# Altium schematic sheet Dual_chanel.SchDoc
size A1; SheetNumber: 2; SheetTotal: 2
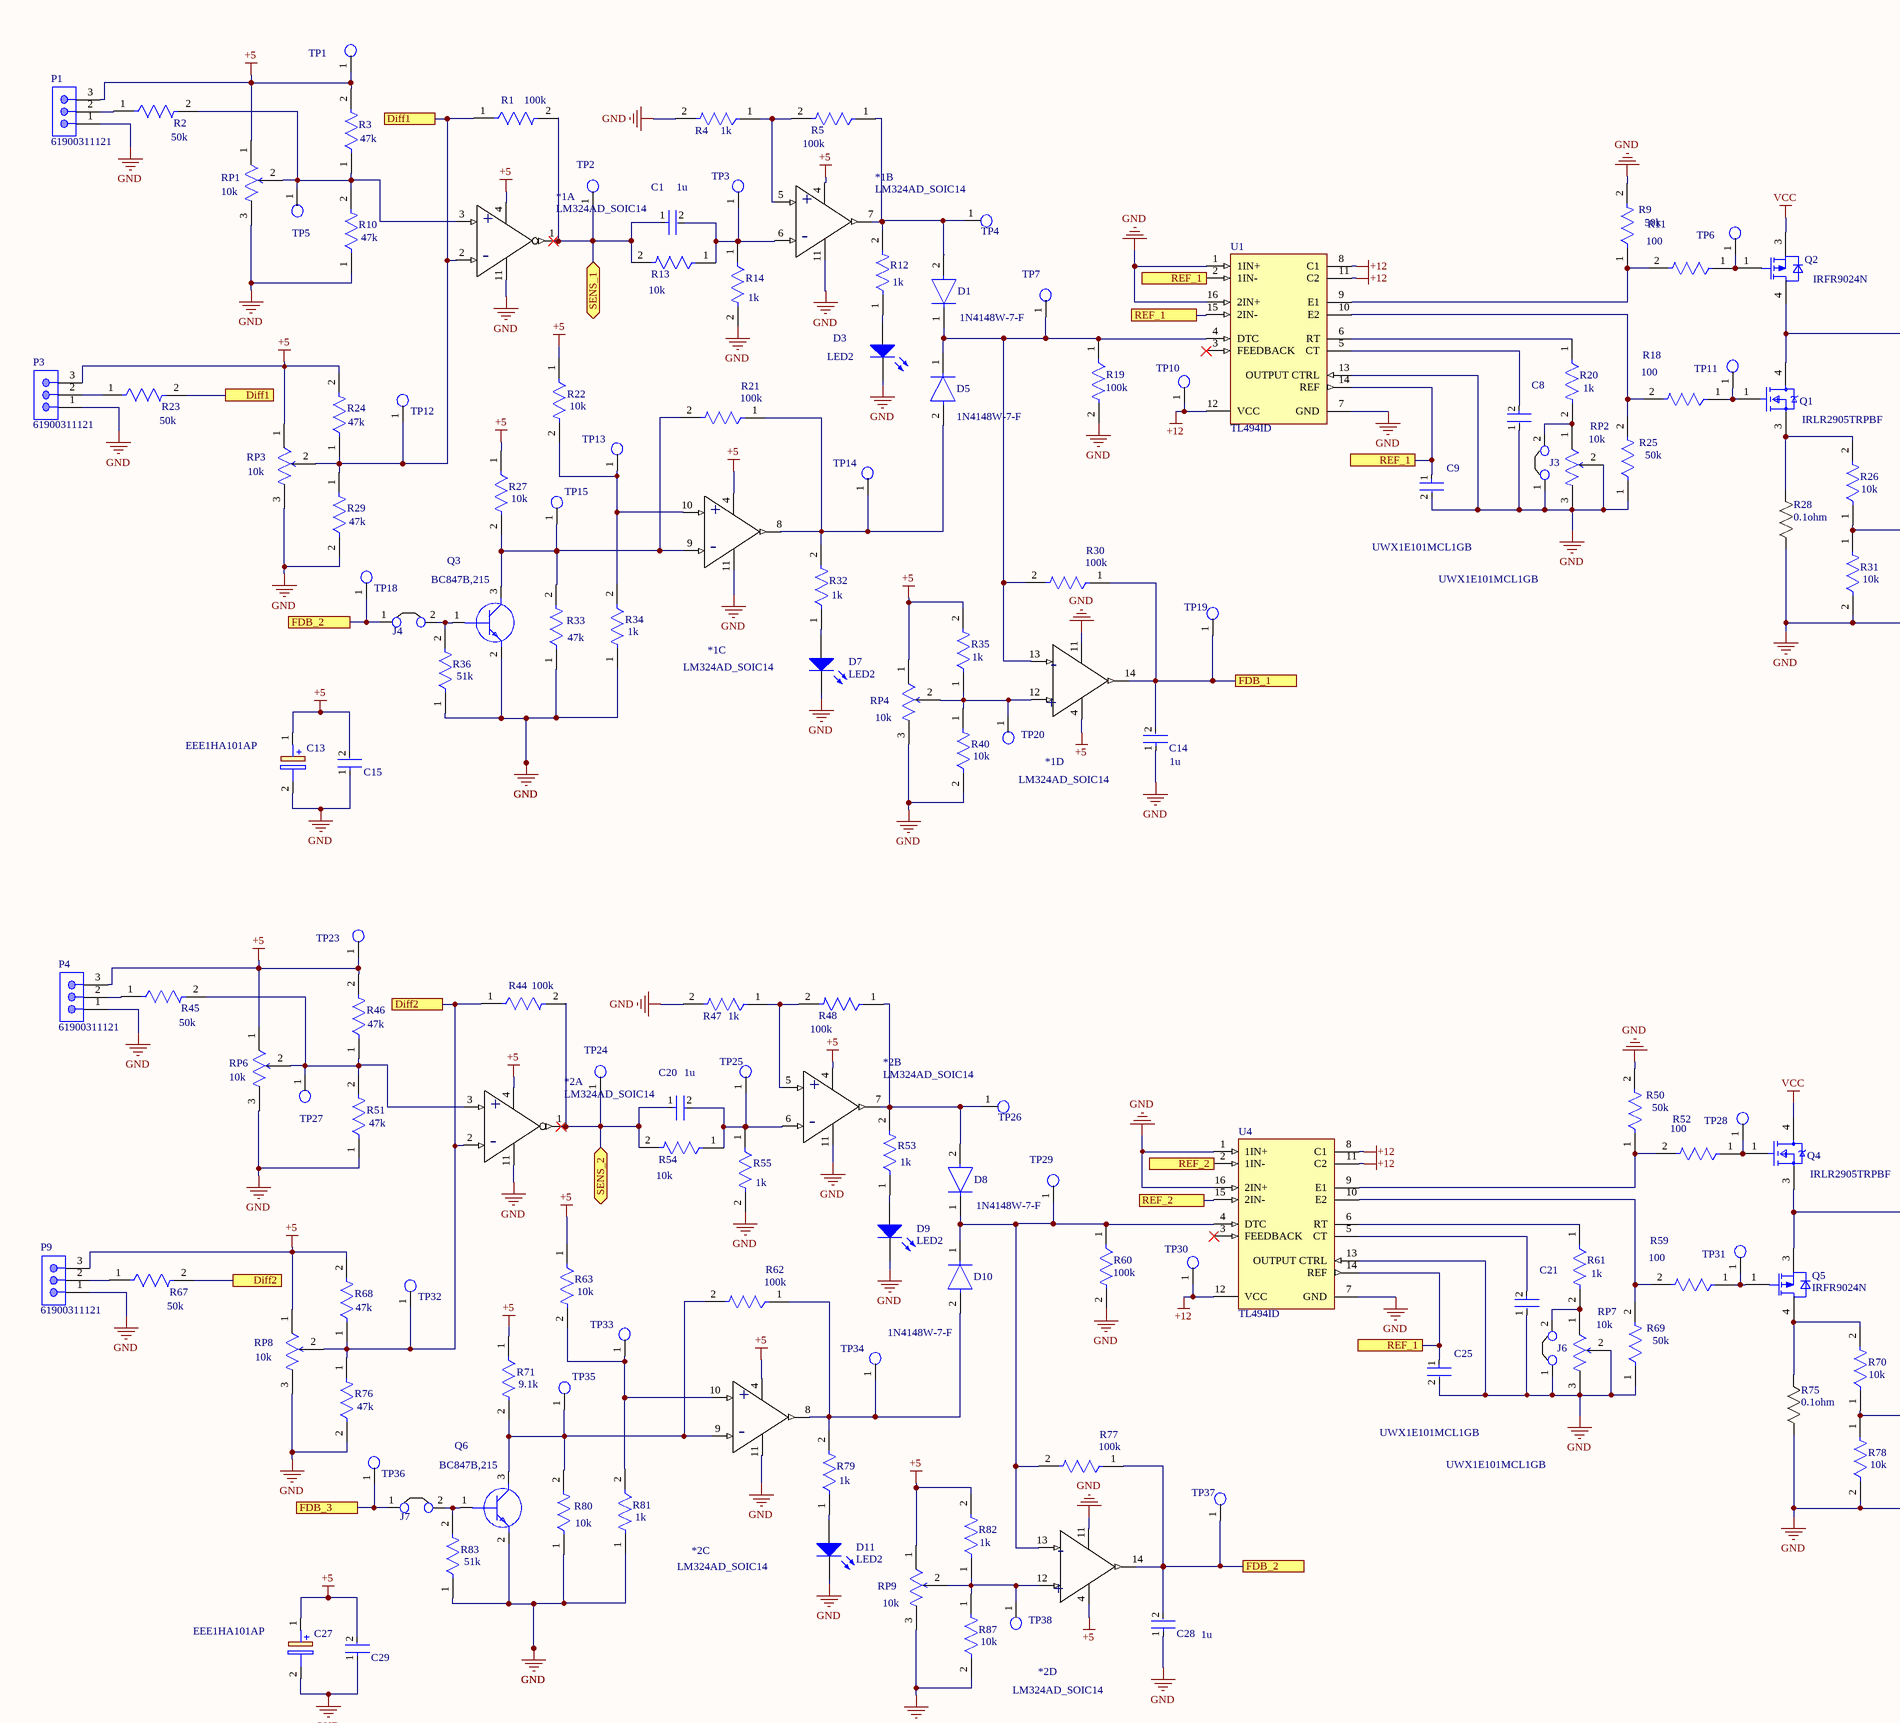
[diagram p0: Dual_chanel.SchDoc, top left]
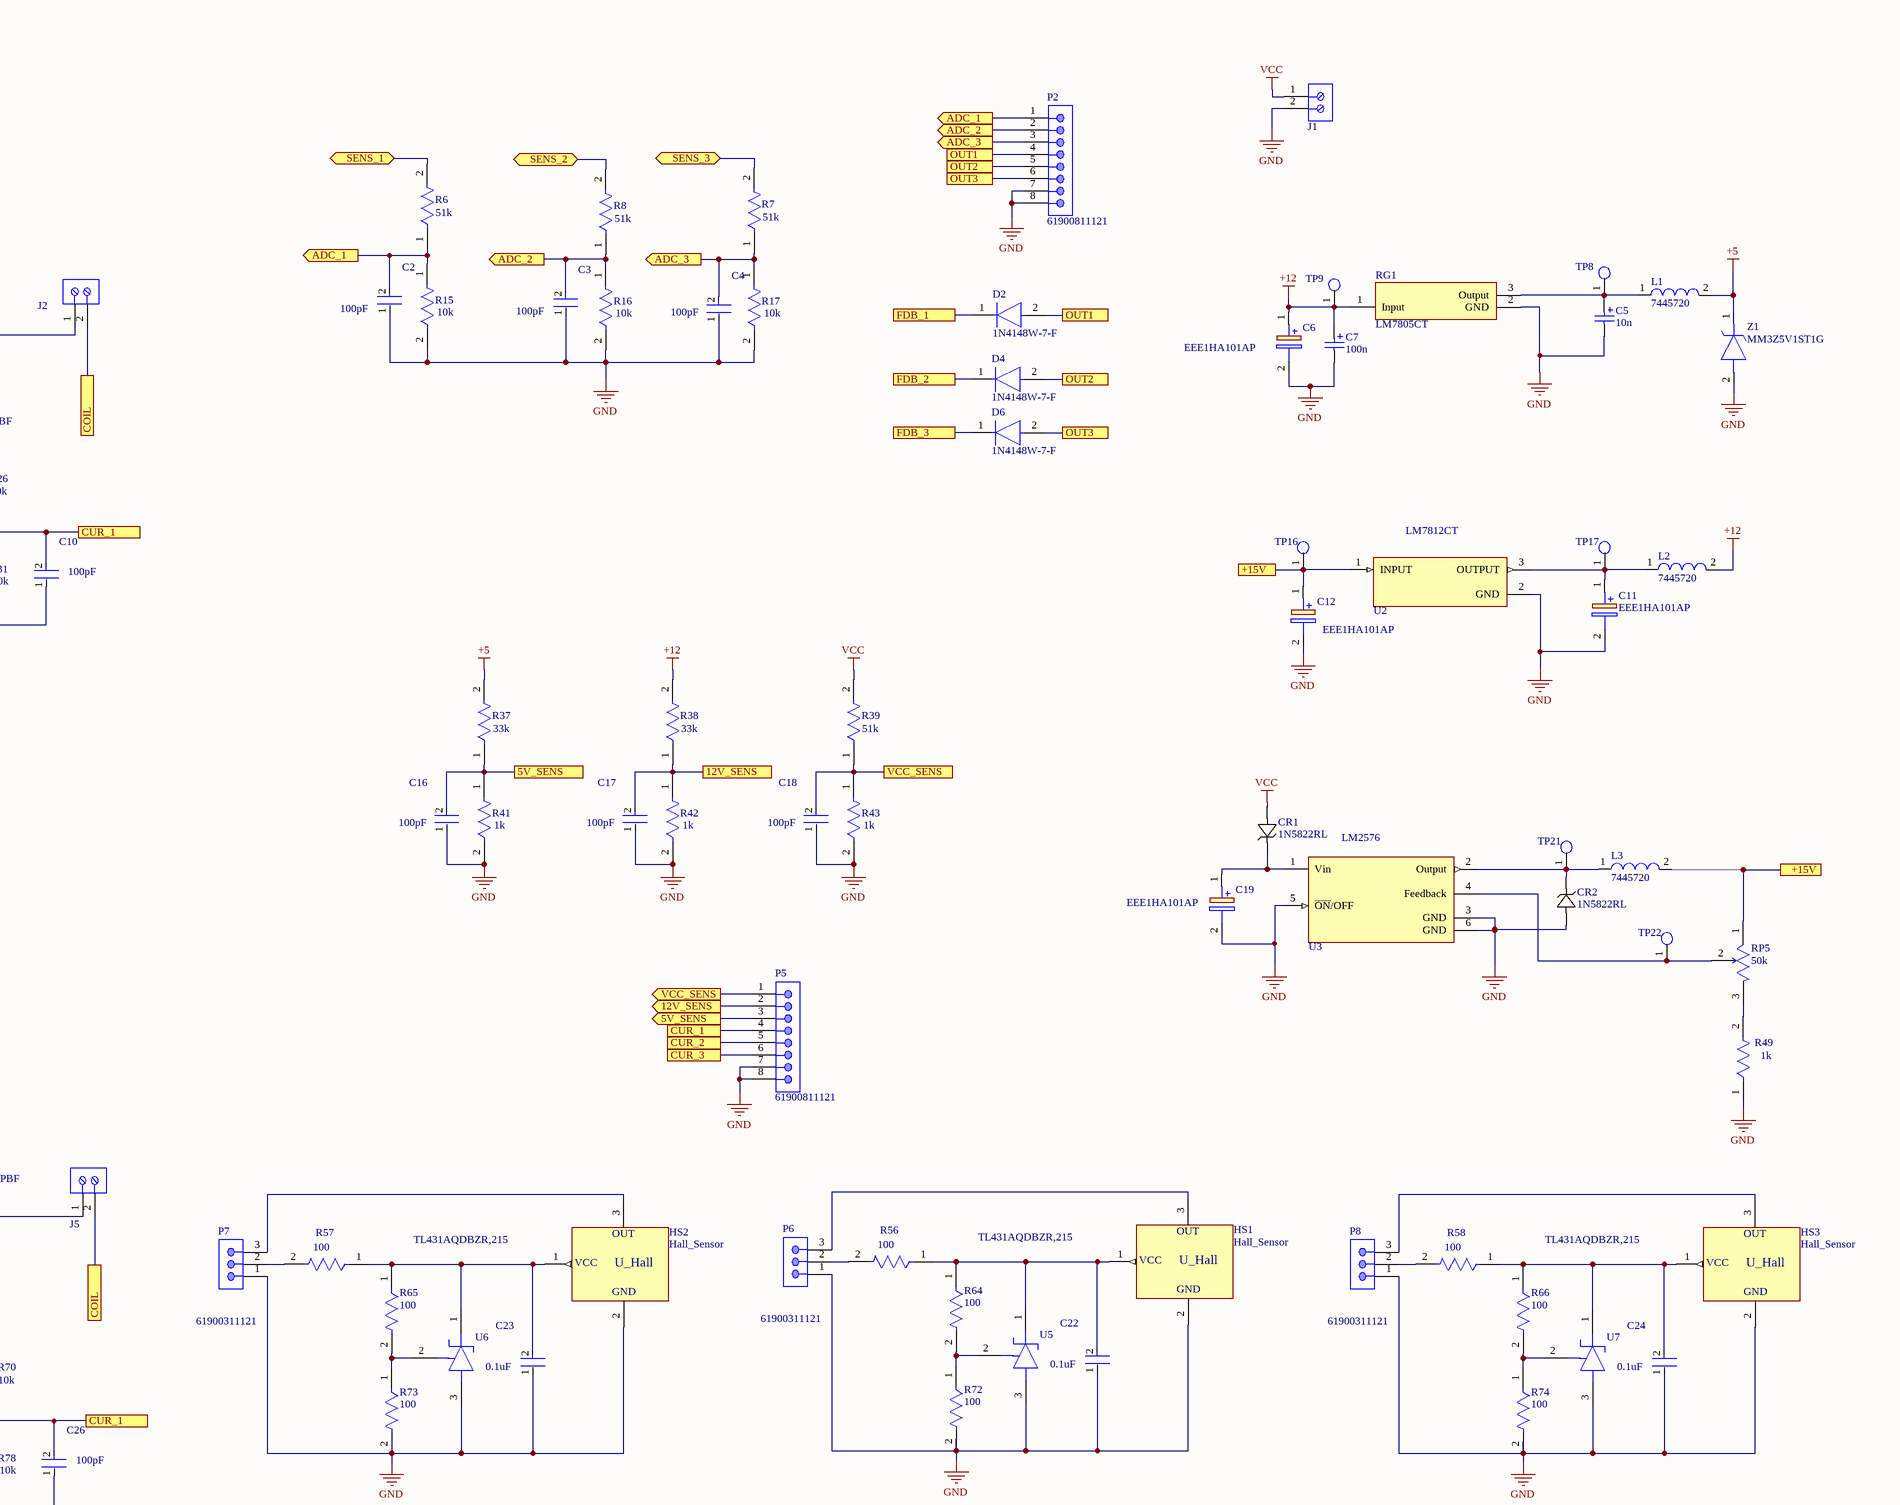
[diagram p1: Dual_chanel.SchDoc, top right]
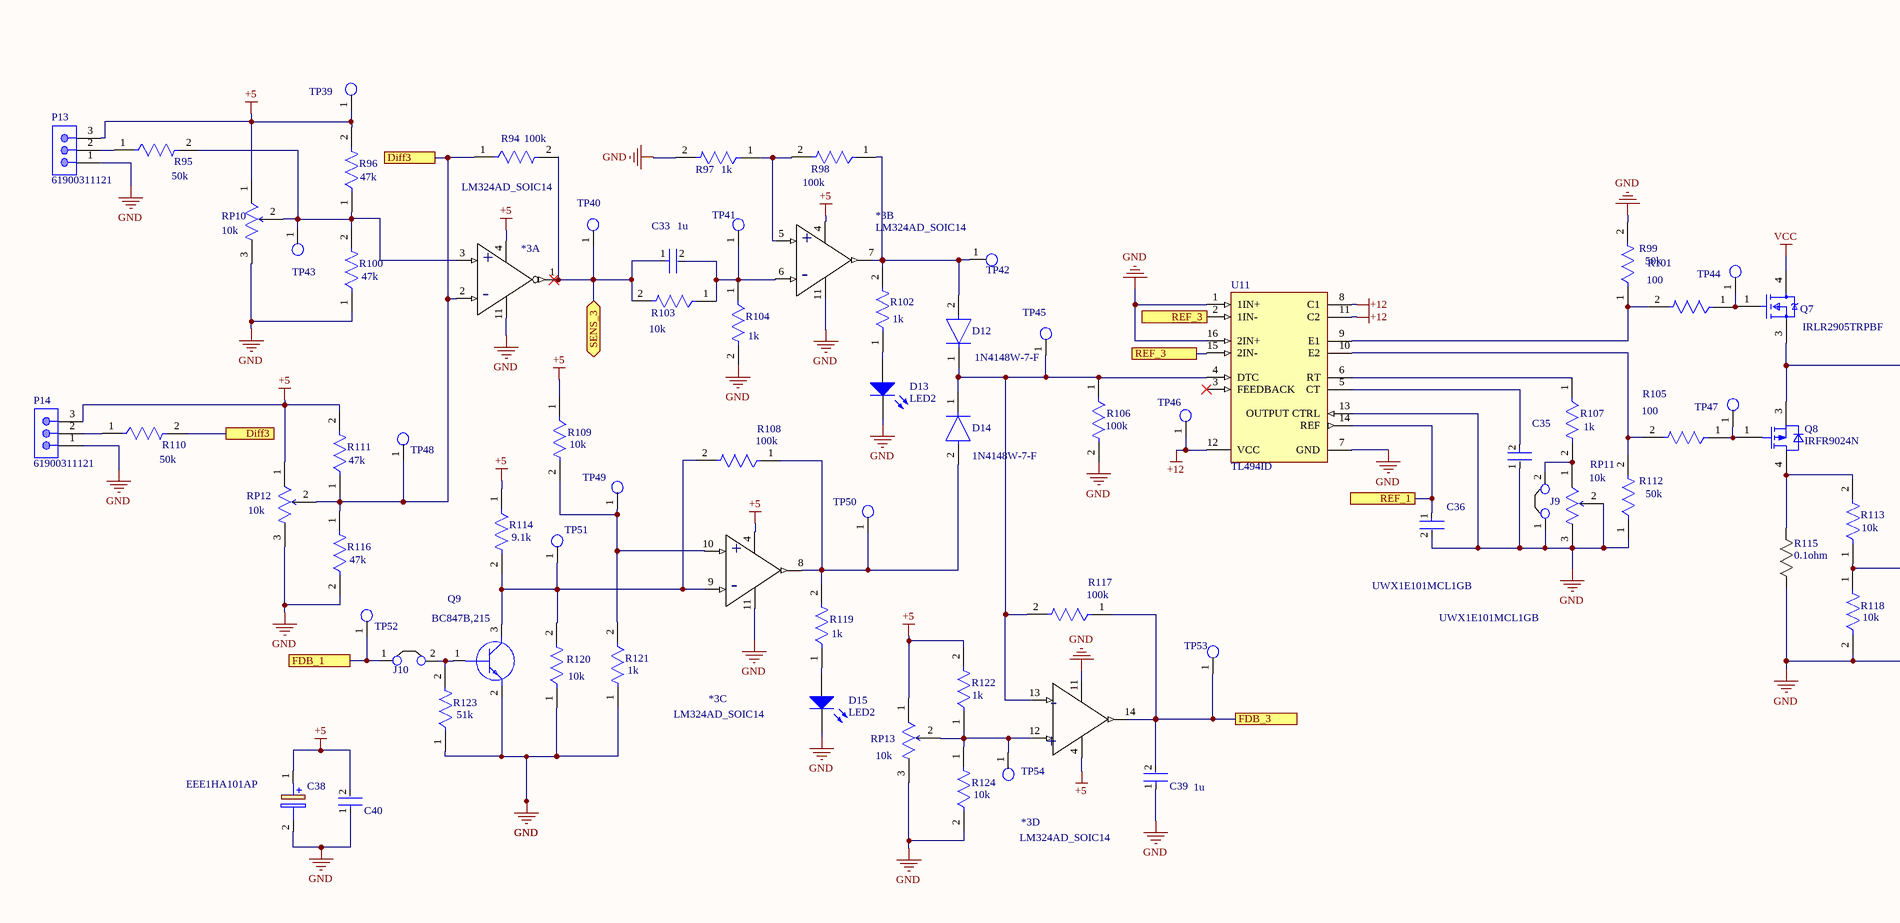
[diagram p2: Dual_chanel.SchDoc, bottom left]
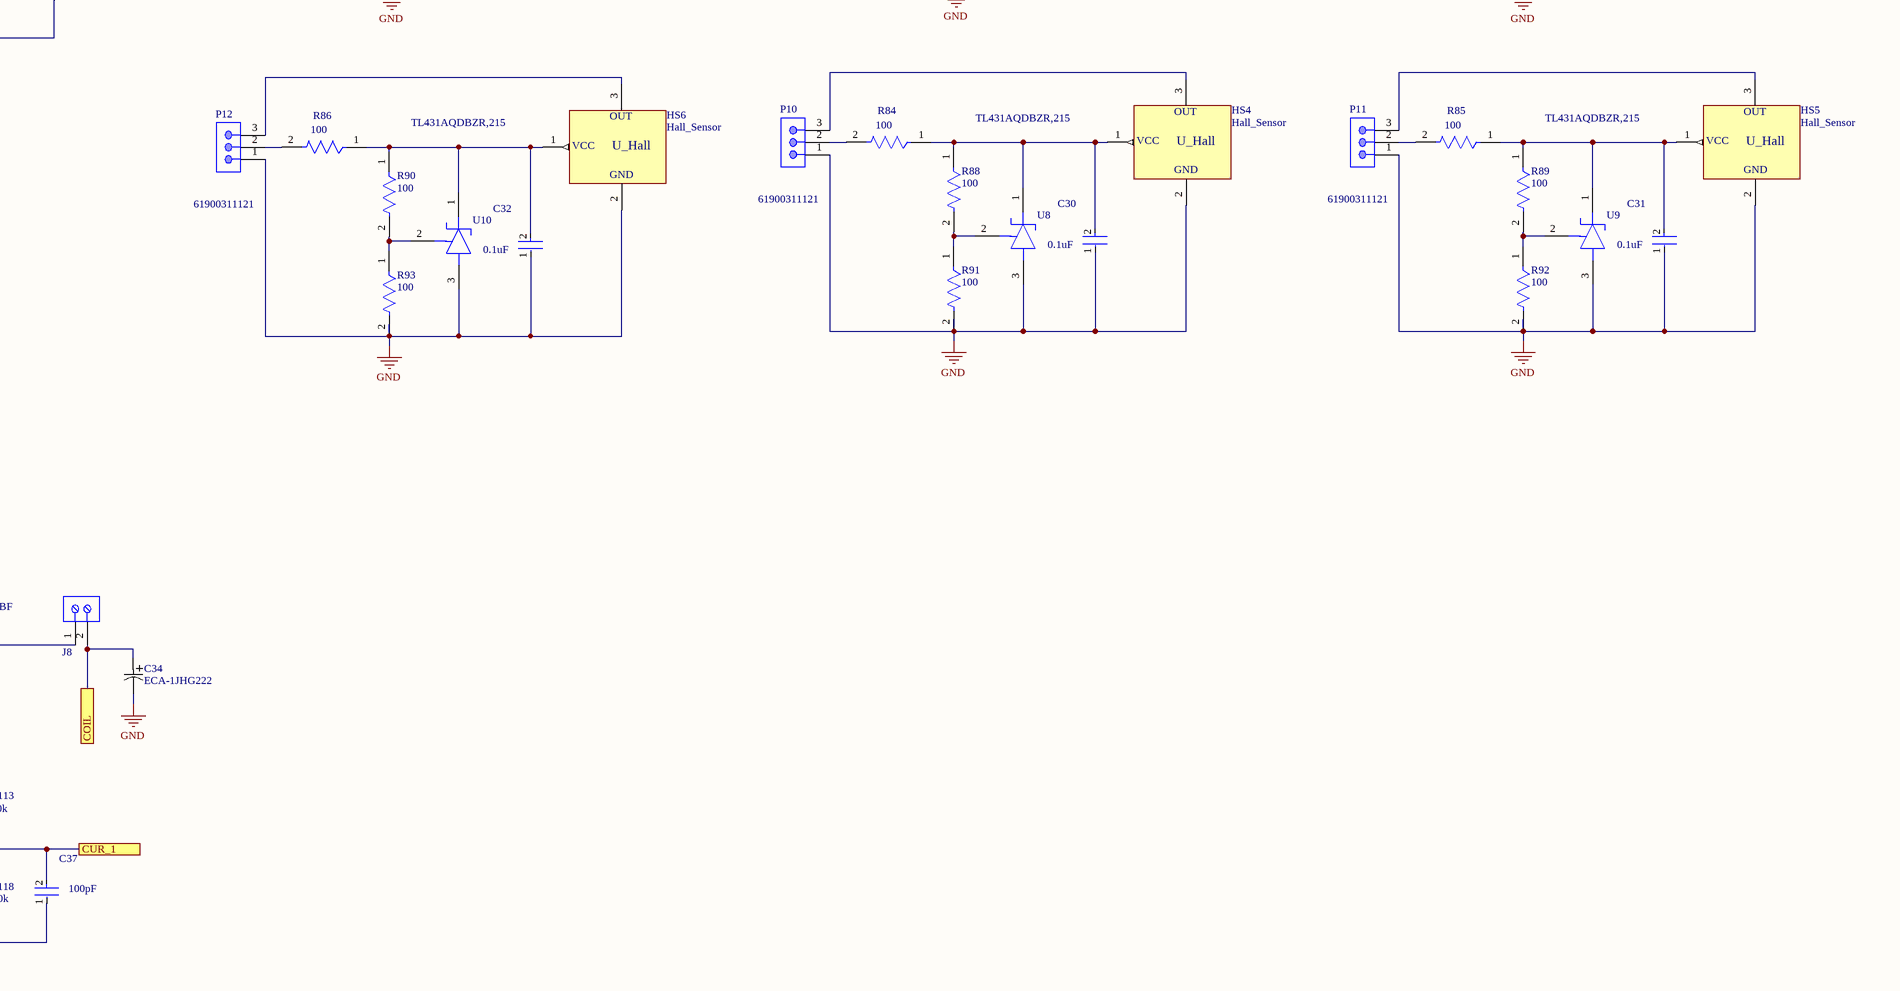
[diagram p3: Dual_chanel.SchDoc, bottom right]

## Parts
*1  LM324AD_SOIC14  [D14-M]  (parts A,B,C,D of 4)
*2  LM324AD_SOIC14  [D14-M]  (parts A,B,C,D of 4)
*3  LM324AD_SOIC14  [D14-M]  (parts A,B,C,D of 4)
C1  1u  [KEMET_C0805C-DN_IPC_A]
C2  100pF  [KEMET_C0805C-DN_IPC_A]
C3  100pF  [KEMET_C0805C-DN_IPC_A]
C4  100pF  [KEMET_C0805C-DN_IPC_A]
C5  10n  [KEMET_C0805C-DN_IPC_A]
C6  EEE1HA101AP  [EEEFK1V331P]
C7  100n  [KEMET_C0805C-DN_IPC_A]
C8  UWX1E101MCL1GB  [KEMET_C0805C-DN_IPC_A]
C9  UWX1E101MCL1GB  [KEMET_C0805C-DN_IPC_A]
C10  100pF  [KEMET_C0805C-DN_IPC_A]
C11  EEE1HA101AP  [EEEFK1V331P]
C12  EEE1HA101AP  [EEEFK1V331P]
C13  EEE1HA101AP  [EEEFK1V331P]
C14  1u  [KEMET_C0805C-DN_IPC_A]
C15  1u  [KEMET_C0805C-DN_IPC_A]  (value not drawn)
C16  100pF  [KEMET_C0805C-DN_IPC_A]
C17  100pF  [KEMET_C0805C-DN_IPC_A]
C18  100pF  [KEMET_C0805C-DN_IPC_A]
C19  EEE1HA101AP  [EEEFK1V331P]
C20  1u  [KEMET_C0805C-DN_IPC_A]
C21  UWX1E101MCL1GB  [KEMET_C0805C-DN_IPC_A]
C22  0.1uF  [KEMET_C0805C-DN_IPC_C]
C23  0.1uF  [KEMET_C0805C-DN_MFG]
C24  0.1uF  [KEMET_C0805C-DN_IPC_C]
C25  UWX1E101MCL1GB  [KEMET_C0805C-DN_IPC_A]
C26  100pF  [KEMET_C0805C-DN_IPC_A]
C27  EEE1HA101AP  [EEEFK1V331P]
C28  1u  [KEMET_C0805C-DN_IPC_A]
C29  1u  [KEMET_C0805C-DN_IPC_A]  (value not drawn)
C30  0.1uF  [KEMET_C0805C-DN_IPC_C]
C31  0.1uF  [KEMET_C0805C-DN_IPC_C]
C32  0.1uF  [KEMET_C0805C-DN_MFG]
C33  1u  [KEMET_C0805C-DN_IPC_A]
C34  ECA-1JHG222  [CAPPRD500W60D1000H1250]
C35  UWX1E101MCL1GB  [KEMET_C0805C-DN_IPC_A]
C36  UWX1E101MCL1GB  [KEMET_C0805C-DN_IPC_A]
C37  100pF  [KEMET_C0805C-DN_IPC_A]
C38  EEE1HA101AP  [EEEFK1V331P]
C39  1u  [KEMET_C0805C-DN_IPC_A]
C40  1u  [KEMET_C0805C-DN_IPC_A]  (value not drawn)
CR1  1N5822RL  [DO-201AD_STM]
CR2  1N5822RL  [DO-201AD_STM]
D1  1N4148W-7-F  [ONSC-SOD-123-2-425-04_V]
D2  1N4148W-7-F  [Vishay_S8-V-3910_01-001_IPC_A]
D3  LED2  [Wurth_Electronics_0_MFG]
D4  1N4148W-7-F  [Vishay_S8-V-3910_01-001_IPC_A]
D5  1N4148W-7-F  [ONSC-SOD-123-2-425-04_V]
D6  1N4148W-7-F  [Vishay_S8-V-3910_01-001_IPC_A]
D7  LED2  [Wurth_Electronics_0_MFG]
D8  1N4148W-7-F  [Vishay_S8-V-3910_01-001_IPC_A]
D9  LED2  [Wurth_Electronics_0_MFG]
D10  1N4148W-7-F  [Vishay_S8-V-3910_01-001_IPC_A]
D11  LED2  [Wurth_Electronics_0_MFG]
D12  1N4148W-7-F  [Vishay_S8-V-3910_01-001_IPC_A]
D13  LED2  [Wurth_Electronics_0_MFG]
D14  1N4148W-7-F  [Vishay_S8-V-3910_01-001_IPC_A]
D15  LED2  [Wurth_Electronics_0_MFG]
HS1  Hall_Sensor  [TO-92A]
HS2  Hall_Sensor  [TO-92A]
HS3  Hall_Sensor  [TO-92A]
HS4  Hall_Sensor  [TO-92A]
HS5  Hall_Sensor  [TO-92A]
HS6  Hall_Sensor  [TO-92A]
J1  691103110003  [691101710002]  (value not drawn)
J2  691101710002  [691101710002]  (value not drawn)
J3  Jumper 1x2.54  [Jumper_2.54]  (value not drawn)
J4  Jumper 1x2.54  [Jumper_2.54]  (value not drawn)
J5  691101710002  [691101710002]  (value not drawn)
J6  Jumper 1x2.54  [Jumper_2.54]  (value not drawn)
J7  Jumper 1x2.54  [Jumper_2.54]  (value not drawn)
J8  691101710002  [691101710002]  (value not drawn)
J9  Jumper 1x2.54  [Jumper_2.54]  (value not drawn)
J10  Jumper 1x2.54  [Jumper_2.54]  (value not drawn)
L1  7445720  [WE-PD2-L]
L2  7445720  [WE-PD2-L]
L3  7445720  [WE-PD2-L]
P1  61900311121  [61900311121]
P2  61900811121  [61900811121]
P3  61900311121  [61900311121]
P4  61900311121  [61900311121]
P5  61900811121  [61900811121]
P6  61900311121  [61900311121]
P7  61900311121  [61900311121]
P8  61900311121  [61900311121]
P9  61900311121  [61900311121]
P10  61900311121  [61900311121]
P11  61900311121  [61900311121]
P12  61900311121  [61900311121]
P13  61900311121  [61900311121]
P14  61900311121  [61900311121]
Q1  IRLR2905TRPBF  [TO229P991X239-3_4N]
Q2  IRFR9024N  [TO229P991X239-3_4N]
Q3  BC847B,215  [BC847B215]
Q4  IRLR2905TRPBF  [Infineon_Technologies_PG-TO252-3_MFG]
Q5  IRFR9024N  [TO229P991X239-3_4N]
Q6  BC847B,215  [BC847B215]
Q7  IRLR2905TRPBF  [Infineon_Technologies_PG-TO252-3_MFG]
Q8  IRFR9024N  [TO229P991X239-3_4N]
Q9  BC847B,215  [BC847B215]
R1  100k  [Vishay_CRCW0805-e3_IPC_A]
R2  50k  [Vishay_CRCW0805-e3_IPC_A]
R3  47k  [Vishay_CRCW0805-e3_IPC_A]
R4  1k  [Vishay_CRCW0805-e3_IPC_A]
R5  100k  [Vishay_CRCW0805-e3_IPC_A]
R6  51k  [Vishay_CRCW0805-e3_IPC_A]
R7  51k  [Vishay_CRCW0805-e3_IPC_A]
R8  51k  [Vishay_CRCW0805-e3_IPC_A]
R9  50k  [Vishay_CRCW0805-e3_IPC_A]
R10  47k  [Vishay_CRCW0805-e3_IPC_A]
R11  100  [Vishay_CRCW0805-e3_IPC_A]
R12  1k  [Vishay_CRCW0805-e3_IPC_A]
R13  10k  [Vishay_CRCW0805-e3_IPC_A]
R14  1k  [Vishay_CRCW0805-e3_IPC_A]
R15  10k  [Vishay_CRCW0805-e3_IPC_A]
R16  10k  [Vishay_CRCW0805-e3_IPC_A]
R17  10k  [Vishay_CRCW0805-e3_IPC_A]
R18  100  [Vishay_CRCW0805-e3_IPC_A]
R19  100k  [Vishay_CRCW0805-e3_IPC_A]
R20  1k  [Vishay_CRCW0805-e3_IPC_A]
R21  100k  [Vishay_CRCW0805-e3_IPC_A]
R22  10k  [Vishay_CRCW0805-e3_IPC_A]
R23  50k  [Vishay_CRCW0805-e3_IPC_A]
R24  47k  [Vishay_CRCW0805-e3_IPC_A]
R25  50k  [Vishay_CRCW0805-e3_IPC_A]
R26  10k  [Vishay_CRCW0805-e3_IPC_A]
R27  10k  [Vishay_CRCW0805-e3_IPC_A]
R28  0.1ohm  [RES_TUM5_OHM]
R29  47k  [Vishay_CRCW0805-e3_IPC_A]
R30  100k  [Vishay_CRCW0805-e3_IPC_A]
R31  10k  [Vishay_CRCW0805-e3_IPC_A]
R32  1k  [Vishay_CRCW0805-e3_IPC_A]
R33  47k  [Vishay_CRCW0805-e3_IPC_A]
R34  1k  [Vishay_CRCW0805-e3_IPC_A]
R35  1k  [Vishay_CRCW0805-e3_IPC_A]
R36  51k  [Vishay_CRCW0805-e3_IPC_A]
R37  33k  [Vishay_CRCW0805-e3_IPC_A]
R38  33k  [Vishay_CRCW0805-e3_IPC_A]
R39  51k  [Vishay_CRCW0805-e3_IPC_A]
R40  10k  [Vishay_CRCW0805-e3_IPC_A]
R41  1k  [Vishay_CRCW0805-e3_IPC_A]
R42  1k  [Vishay_CRCW0805-e3_IPC_A]
R43  1k  [Vishay_CRCW0805-e3_IPC_A]
R44  100k  [Vishay_CRCW0805-e3_IPC_A]
R45  50k  [Vishay_CRCW0805-e3_IPC_A]
R46  47k  [Vishay_CRCW0805-e3_IPC_A]
R47  1k  [Vishay_CRCW0805-e3_IPC_A]
R48  100k  [Vishay_CRCW0805-e3_IPC_A]
R49  1k  [Vishay_CRCW0805-e3_IPC_A]
R50  50k  [Vishay_CRCW0805-e3_IPC_A]
R51  47k  [Vishay_CRCW0805-e3_IPC_A]
R52  100  [Vishay_CRCW0805-e3_IPC_A]
R53  1k  [Vishay_CRCW0805-e3_IPC_A]
R54  10k  [Vishay_CRCW0805-e3_IPC_A]
R55  1k  [Vishay_CRCW0805-e3_IPC_A]
R56  100  [Vishay_CRCW0805-e3_IPC_B]
R57  100  [Vishay_CRCW0805-e3_IPC_B]
R58  100  [Vishay_CRCW0805-e3_IPC_B]
R59  100  [Vishay_CRCW0805-e3_IPC_A]
R60  100k  [Vishay_CRCW0805-e3_IPC_A]
R61  1k  [Vishay_CRCW0805-e3_IPC_A]
R62  100k  [Vishay_CRCW0805-e3_IPC_A]
R63  10k  [Vishay_CRCW0805-e3_IPC_A]
R64  100  [Vishay_CRCW0805-e3_IPC_B]
R65  100  [Vishay_CRCW0805-e3_IPC_B]
R66  100  [Vishay_CRCW0805-e3_IPC_B]
R67  50k  [Vishay_CRCW0805-e3_IPC_A]
R68  47k  [Vishay_CRCW0805-e3_IPC_A]
R69  50k  [Vishay_CRCW0805-e3_IPC_A]
R70  10k  [Vishay_CRCW0805-e3_IPC_A]
R71  9.1k  [Vishay_CRCW0805-e3_IPC_A]
R72  100  [Vishay_CRCW0805-e3_IPC_B]
R73  100  [Vishay_CRCW0805-e3_IPC_B]
R74  100  [Vishay_CRCW0805-e3_IPC_B]
R75  0.1ohm  [RES_TUM5_OHM]
R76  47k  [Vishay_CRCW0805-e3_IPC_A]
R77  100k  [Vishay_CRCW0805-e3_IPC_A]
R78  10k  [Vishay_CRCW0805-e3_IPC_A]
R79  1k  [Vishay_CRCW0805-e3_IPC_A]
R80  10k  [Vishay_CRCW0805-e3_IPC_A]
R81  1k  [Vishay_CRCW0805-e3_IPC_A]
R82  1k  [Vishay_CRCW0805-e3_IPC_A]
R83  51k  [Vishay_CRCW0805-e3_IPC_A]
R84  100  [Vishay_CRCW0805-e3_IPC_B]
R85  100  [Vishay_CRCW0805-e3_IPC_B]
R86  100  [Vishay_CRCW0805-e3_IPC_B]
R87  10k  [Vishay_CRCW0805-e3_IPC_A]
R88  100  [Vishay_CRCW0805-e3_IPC_B]
R89  100  [Vishay_CRCW0805-e3_IPC_B]
R90  100  [Vishay_CRCW0805-e3_IPC_B]
R91  100  [Vishay_CRCW0805-e3_IPC_B]
R92  100  [Vishay_CRCW0805-e3_IPC_B]
R93  100  [Vishay_CRCW0805-e3_IPC_B]
R94  100k  [Vishay_CRCW0805-e3_IPC_A]
R95  50k  [Vishay_CRCW0805-e3_IPC_A]
R96  47k  [Vishay_CRCW0805-e3_IPC_A]
R97  1k  [Vishay_CRCW0805-e3_IPC_A]
R98  100k  [Vishay_CRCW0805-e3_IPC_A]
R99  50k  [Vishay_CRCW0805-e3_IPC_A]
R100  47k  [Vishay_CRCW0805-e3_IPC_A]
R101  100  [Vishay_CRCW0805-e3_IPC_A]
R102  1k  [Vishay_CRCW0805-e3_IPC_A]
R103  10k  [Vishay_CRCW0805-e3_IPC_A]
R104  1k  [Vishay_CRCW0805-e3_IPC_A]
R105  100  [Vishay_CRCW0805-e3_IPC_A]
R106  100k  [Vishay_CRCW0805-e3_IPC_A]
R107  1k  [Vishay_CRCW0805-e3_IPC_A]
R108  100k  [Vishay_CRCW0805-e3_IPC_A]
R109  10k  [Vishay_CRCW0805-e3_IPC_A]
R110  50k  [Vishay_CRCW0805-e3_IPC_A]
R111  47k  [Vishay_CRCW0805-e3_IPC_A]
R112  50k  [Vishay_CRCW0805-e3_IPC_A]
R113  10k  [Vishay_CRCW0805-e3_IPC_A]
R114  9.1k  [Vishay_CRCW0805-e3_IPC_A]
R115  0.1ohm  [RES_TUM5_OHM]
R116  47k  [Vishay_CRCW0805-e3_IPC_A]
R117  100k  [Vishay_CRCW0805-e3_IPC_A]
R118  10k  [Vishay_CRCW0805-e3_IPC_A]
R119  1k  [Vishay_CRCW0805-e3_IPC_A]
R120  10k  [Vishay_CRCW0805-e3_IPC_A]
R121  1k  [Vishay_CRCW0805-e3_IPC_A]
R122  1k  [Vishay_CRCW0805-e3_IPC_A]
R123  51k  [Vishay_CRCW0805-e3_IPC_A]
R124  10k  [Vishay_CRCW0805-e3_IPC_A]
RG1  Part Number: LM7805CT  [Fairchild_LM7805CT_0]  (hidden comment: Reg_Fairchild_LM7805CT_eec)
RP1  10k  [Bourns_3296W_MFG]
RP2  10k  [Bourns_3296W_MFG]
RP3  10k  [Bourns_3296W_MFG]
RP4  10k  [Bourns_3296W_MFG]
RP5  50k  [Bourns_3296W_MFG]
RP6  10k  [Bourns_3296W_MFG]
RP7  10k  [Bourns_3296W_MFG]
RP8  10k  [Bourns_3296W_MFG]
RP9  10k  [Bourns_3296W_MFG]
RP10  10k  [Bourns_3296W_MFG]
RP11  10k  [Bourns_3296W_MFG]
RP12  10k  [Bourns_3296W_MFG]
RP13  10k  [Bourns_3296W_MFG]
TP1  Test_Point_PCB  [Test_Point]  (value not drawn)
TP2  Test_Point_PCB  [Test_Point]  (value not drawn)
TP3  Test_Point_PCB  [Test_Point]  (value not drawn)
TP4  Test_Point_PCB  [Test_Point]  (value not drawn)
TP5  Test_Point_PCB  [Test_Point]  (value not drawn)
TP6  Test_Point_PCB  [Test_Point]  (value not drawn)
TP7  Test_Point_PCB  [Test_Point]  (value not drawn)
TP8  Test_Point_PCB  [Test_Point]  (value not drawn)
TP9  Test_Point_PCB  [Test_Point]  (value not drawn)
TP10  Test_Point_PCB  [Test_Point]  (value not drawn)
TP11  Test_Point_PCB  [Test_Point]  (value not drawn)
TP12  Test_Point_PCB  [Test_Point]  (value not drawn)
TP13  Test_Point_PCB  [Test_Point]  (value not drawn)
TP14  Test_Point_PCB  [Test_Point]  (value not drawn)
TP15  Test_Point_PCB  [Test_Point]  (value not drawn)
TP16  Test_Point_PCB  [Test_Point]  (value not drawn)
TP17  Test_Point_PCB  [Test_Point]  (value not drawn)
TP18  Test_Point_PCB  [Test_Point]  (value not drawn)
TP19  Test_Point_PCB  [Test_Point]  (value not drawn)
TP20  Test_Point_PCB  [Test_Point]  (value not drawn)
TP21  Test_Point_PCB  [Test_Point]  (value not drawn)
TP22  Test_Point_PCB  [Test_Point]  (value not drawn)
TP23  Test_Point_PCB  [Test_Point]  (value not drawn)
TP24  Test_Point_PCB  [Test_Point]  (value not drawn)
TP25  Test_Point_PCB  [Test_Point]  (value not drawn)
TP26  Test_Point_PCB  [Test_Point]  (value not drawn)
TP27  Test_Point_PCB  [Test_Point]  (value not drawn)
TP28  Test_Point_PCB  [Test_Point]  (value not drawn)
TP29  Test_Point_PCB  [Test_Point]  (value not drawn)
TP30  Test_Point_PCB  [Test_Point]  (value not drawn)
TP31  Test_Point_PCB  [Test_Point]  (value not drawn)
TP32  Test_Point_PCB  [Test_Point]  (value not drawn)
TP33  Test_Point_PCB  [Test_Point]  (value not drawn)
TP34  Test_Point_PCB  [Test_Point]  (value not drawn)
TP35  Test_Point_PCB  [Test_Point]  (value not drawn)
TP36  Test_Point_PCB  [Test_Point]  (value not drawn)
TP37  Test_Point_PCB  [Test_Point]  (value not drawn)
TP38  Test_Point_PCB  [Test_Point]  (value not drawn)
TP39  Test_Point_PCB  [Test_Point]  (value not drawn)
TP40  Test_Point_PCB  [Test_Point]  (value not drawn)
TP41  Test_Point_PCB  [Test_Point]  (value not drawn)
TP42  Test_Point_PCB  [Test_Point]  (value not drawn)
TP43  Test_Point_PCB  [Test_Point]  (value not drawn)
TP44  Test_Point_PCB  [Test_Point]  (value not drawn)
TP45  Test_Point_PCB  [Test_Point]  (value not drawn)
TP46  Test_Point_PCB  [Test_Point]  (value not drawn)
TP47  Test_Point_PCB  [Test_Point]  (value not drawn)
TP48  Test_Point_PCB  [Test_Point]  (value not drawn)
TP49  Test_Point_PCB  [Test_Point]  (value not drawn)
TP50  Test_Point_PCB  [Test_Point]  (value not drawn)
TP51  Test_Point_PCB  [Test_Point]  (value not drawn)
TP52  Test_Point_PCB  [Test_Point]  (value not drawn)
TP53  Test_Point_PCB  [Test_Point]  (value not drawn)
TP54  Test_Point_PCB  [Test_Point]  (value not drawn)
U1  TL494ID  [D16-M]
U2  LM7812CT  [Fairchild_LM7805CT_0]
U3  LM2576  [ON_Semiconductor_936A-02_MFG]
U4  TL494ID  [D16-M]
U5  Part Number: TL431AQDBZR,215  [Nexperia_TL431AQDBZR,215_0]  (hidden comment: IC_Nexperia_TL431AQDBZR,215_eec)
U6  Part Number: TL431AQDBZR,215  [Nexperia_TL431AQDBZR,215_0]  (hidden comment: IC_Nexperia_TL431AQDBZR,215_eec)
U7  Part Number: TL431AQDBZR,215  [Nexperia_TL431AQDBZR,215_0]  (hidden comment: IC_Nexperia_TL431AQDBZR,215_eec)
U8  Part Number: TL431AQDBZR,215  [Nexperia_TL431AQDBZR,215_0]  (hidden comment: IC_Nexperia_TL431AQDBZR,215_eec)
U9  Part Number: TL431AQDBZR,215  [Nexperia_TL431AQDBZR,215_0]  (hidden comment: IC_Nexperia_TL431AQDBZR,215_eec)
U10  Part Number: TL431AQDBZR,215  [Nexperia_TL431AQDBZR,215_0]  (hidden comment: IC_Nexperia_TL431AQDBZR,215_eec)
U11  TL494ID  [D16-M]
Z1  MM3Z5V1ST1G  [SOD2512X110N]

## Ports
5V_SENS, 5V_SENS (out), 12V_SENS, 12V_SENS (out), +15V, ADC_1 (out), ADC_2 (out), ADC_3 (out), COIL, CUR_1, CUR_2, CUR_3, Diff1, Diff2, Diff3, FDB_1, FDB_2, FDB_3, OUT1, OUT2, OUT3, REF_1, REF_2, REF_3, SENS_1 (bidir), SENS_2 (bidir), SENS_3 (bidir), VCC_SENS, VCC_SENS (out)

## Nets
+5: *1.4(+VCC) *2.4(+VCC) *3.4(+VCC) C13.1(+) C15.2 C27.1(+) C29.2 C38.1(+) C40.2 L1.2 P1.3 P3.3 P4.3 P9.3 P13.3 P14.3 R3.2 R22.1 R24.2 R27.1 R35.2 R37.2 R46.2 R63.1 R68.2 R71.1 R82.2 R96.2 R109.1 R111.2 R114.1 R122.2 RP1.1(CCW) RP3.1(CCW) RP4.1(CCW) RP6.1(CCW) RP8.1(CCW) RP9.1(CCW) RP10.1(CCW) RP12.1(CCW) RP13.1(CCW) TP1.1(G9) TP23.1(G9) TP39.1(G9) Z1.1(K)
+12: C6.1(+) C7.1 L2.2 R38.2 RG1.1(Input) TP9.1(G9) TP10.1(G9) TP30.1(G9) TP46.1(G9) U1.8(C1) U1.11(C2) U1.12(VCC) U4.8(C1) U4.11(C2) U4.12(VCC) U11.8(C1) U11.11(C2) U11.12(VCC)
GND: *1.11(GND) *2.11(GND) *3.11(GND) C2.1 C3.1 C4.1 C5.2 C6.2(-) C7.2 C8.1 C9.2 C10.1 C11.2(-) C12.2(-) C13.2(-) C14.1 C15.1 C16.1 C17.1 C18.1 C19.2(-) C21.1 C22.1 C23.1 C24.1 C25.2 C26.1 C27.2(-) C28.1 C29.1 C30.1 C31.1 C32.1 C34.2 C35.1 C36.2 C37.1 C38.2(-) C39.1 C40.1 CR2.2 D3.2(K) D7.2(K) D9.2(K) D11.2(K) D13.2(K) D15.2(K) HS1.2(GND) HS2.2(GND) HS3.2(GND) HS4.2(GND) HS5.2(GND) HS6.2(GND) J1.2 J3.1 J6.1 J9.1 P1.1 P2.7 P2.8 P3.1 P4.1 P5.7 P5.8 P6.1 P7.1 P8.1 P9.1 P10.1 P11.1 P12.1 P13.1 P14.1 Q3.2(E) Q6.2(E) Q9.2(E) R4.2 R9.2 R10.1 R14.2 R15.2 R16.2 R17.2 R19.2 R25.1 R28.1 R29.2 R31.2 R33.1 R34.1 R36.1 R40.2 R41.2 R42.2 R43.2 R47.2 R49.1 R50.2 R51.1 R55.2 R60.2 R69.1 R72.2 R73.2 R74.2 R75.1 R76.2 R78.2 R80.1 R81.1 R83.1 R87.2 R91.2 R92.2 R93.2 R97.2 R99.2 R100.1 R104.2 R106.2 R112.1 R115.1 R116.2 R118.2 R120.1 R121.1 R123.1 R124.2 RG1.2(GND) RP1.3(CW) RP2.2(WIPER) RP2.3(CW) RP3.3(CW) RP4.3(CW) RP6.3(CW) RP7.2(WIPER) RP7.3(CW) RP8.3(CW) RP9.3(CW) RP10.3(CW) RP11.2(WIPER) RP11.3(CW) RP12.3(CW) RP13.3(CW) U1.1(1IN+) U1.7(GND) U1.13(OUTPUT_CTRL) U1.16(2IN+) U2.2(GND) U3.3(GND) U3.5(~{ON}/OFF) U3.6(GND) U4.1(1IN+) U4.7(GND) U4.13(OUTPUT_CTRL) U4.16(2IN+) U5.3(a) U6.3(a) U7.3(a) U8.3(a) U9.3(a) U10.3(a) U11.1(1IN+) U11.7(GND) U11.13(OUTPUT_CTRL) U11.16(2IN+) Z1.2(A)
VCC: CR1.2 J1.1 Q2.3(SOURCE) Q4.4(DRAIN) Q7.4(DRAIN) R39.2
5V_SENS: C16.2 P5.3 R37.1 R41.1 ; port 5V_SENS
12V_SENS: C17.2 P5.2 R38.1 R42.1 ; port 12V_SENS
+15V: C12.1(+) L3.2 RP5.1(CCW) TP16.1(G9) U2.1(INPUT) ; port +15V
ADC_1: C2.2 P2.1 R6.1 R15.1 ; port ADC_1
ADC_2: C3.2 P2.2 R8.1 R16.1 ; port ADC_2
ADC_3: C4.2 P2.3 R7.1 R17.1 ; port ADC_3
COIL: C34.1 J2.2 J5.2 J8.2 ; port COIL
CUR_1: C10.2 C26.2 C37.2 P5.4 R26.1 R31.1 R70.1 R78.1 R113.1 R118.1 ; port CUR_1
CUR_2: P5.5 ; port CUR_2
CUR_3: P5.6 ; port CUR_3
Diff1: *1.2(-INP_1) R1.1 R23.2 R24.1 R29.1 RP3.2(WIPER) TP12.1(G9) ; port Diff1
Diff2: *2.2(-INP_1) R44.1 R67.2 R68.1 R76.1 RP8.2(WIPER) TP32.1(G9) ; port Diff2
Diff3: *3.2(-INP_1) R94.1 R110.2 R111.1 R116.1 RP12.2(WIPER) TP48.1(G9) ; port Diff3
FDB_1: *1.14(OUT_4) C14.2 D2.1(C) J10.1 R30.1 TP19.1(G9) TP52.1(G9) ; port FDB_1
FDB_2: *2.14(OUT_4) C28.2 D4.1(C) J4.1 R77.1 TP18.1(G9) TP37.1(G9) ; port FDB_2
FDB_3: *3.14(OUT_4) C39.2 D6.1(C) J7.1 R117.1 TP36.1(G9) TP53.1(G9) ; port FDB_3
OUT1: D2.2(A) P2.4 ; port OUT1
OUT2: D4.2(A) P2.5 ; port OUT2
OUT3: D6.2(A) P2.6 ; port OUT3
REF_1: C9.1 C25.1 C36.1 U1.2(1IN-) U1.14(REF) U1.15(2IN-) U4.14(REF) U11.14(REF) ; port REF_1
REF_2: U4.2(1IN-) U4.15(2IN-) ; port REF_2
REF_3: U11.2(1IN-) U11.15(2IN-) ; port REF_3
SENS_1: *1.1(OUT_1) C1.1 R1.2 R6.2 R13.2 TP2.1(G9) ; port SENS_1
SENS_2: *2.1(OUT_1) C20.1 R8.2 R44.2 R54.2 TP24.1(G9) ; port SENS_2
SENS_3: *3.1(OUT_1) C33.1 R7.2 R94.2 R103.2 TP40.1(G9) ; port SENS_3
VCC_SENS: C18.2 P5.1 R39.1 R43.1 ; port VCC_SENS
Net*1_3: *1.3(+INP_1) R2.2 R3.1 R10.2 RP1.2(WIPER) TP5.1(G9)
Net*1_5: *1.5(+INP_2) R4.1 R5.2
Net*1_6: *1.6(-INP_2) C1.2 R13.1 R14.1 TP3.1(G9)
Net*1_7: *1.7(OUT_2) D1.2(A) R5.1 R12.2 TP4.1(G9)
Net*1_8: *1.8(OUT_3) D5.2(A) R21.1 R32.2 TP14.1(G9)
Net*1_9: *1.9(-INP_3) Q3.3(C) R21.2 R27.2 R33.2 TP15.1(G9)
Net*1_10: *1.10(+INP_3) R22.2 R34.2 TP13.1(G9)
Net*1_12: *1.12(+INP_4) R35.1 R40.1 RP4.2(WIPER) TP20.1(G9)
Net*1_13: *1.13(-INP_4) D1.1(C) D5.1(C) R19.1 R30.2 TP7.1(G9) U1.4(DTC)
Net*2_3: *2.3(+INP_1) R45.2 R46.1 R51.2 RP6.2(WIPER) TP27.1(G9)
Net*2_5: *2.5(+INP_2) R47.1 R48.2
Net*2_6: *2.6(-INP_2) C20.2 R54.1 R55.1 TP25.1(G9)
Net*2_7: *2.7(OUT_2) D8.2(A) R48.1 R53.2 TP26.1(G9)
Net*2_8: *2.8(OUT_3) D10.2(A) R62.1 R79.2 TP34.1(G9)
Net*2_9: *2.9(-INP_3) Q6.3(C) R62.2 R71.2 R80.2 TP35.1(G9)
Net*2_10: *2.10(+INP_3) R63.2 R81.2 TP33.1(G9)
Net*2_12: *2.12(+INP_4) R82.1 R87.1 RP9.2(WIPER) TP38.1(G9)
Net*2_13: *2.13(-INP_4) D8.1(C) D10.1(C) R60.1 R77.2 TP29.1(G9) U4.4(DTC)
Net*3_3: *3.3(+INP_1) R95.2 R96.1 R100.2 RP10.2(WIPER) TP43.1(G9)
Net*3_5: *3.5(+INP_2) R97.1 R98.2
Net*3_6: *3.6(-INP_2) C33.2 R103.1 R104.1 TP41.1(G9)
Net*3_7: *3.7(OUT_2) D12.2(A) R98.1 R102.2 TP42.1(G9)
Net*3_8: *3.8(OUT_3) D14.2(A) R108.1 R119.2 TP50.1(G9)
Net*3_9: *3.9(-INP_3) Q9.3(C) R108.2 R114.2 R120.2 TP51.1(G9)
Net*3_10: *3.10(+INP_3) R109.2 R121.2 TP49.1(G9)
Net*3_12: *3.12(+INP_4) R122.1 R124.1 RP13.2(WIPER) TP54.1(G9)
Net*3_13: *3.13(-INP_4) D12.1(C) D14.1(C) R106.1 R117.2 TP45.1(G9) U11.4(DTC)
NetC5_1: C5.1 L1.1 RG1.3(Output) TP8.1(G9)
NetC8_2: C8.2 U1.5(CT)
NetC11_1: C11.1(+) L2.1 TP17.1(G9) U2.3(OUTPUT)
NetC19_1: C19.1(+) CR1.1 U3.1(Vin)
NetC21_2: C21.2 U4.5(CT)
NetC22_2: C22.2 HS1.1(OUT) R56.1 R64.1 U5.1(k)
NetC23_2: C23.2 HS2.1(OUT) R57.1 R65.1 U6.1(k)
NetC24_2: C24.2 HS3.1(OUT) R58.1 R66.1 U7.1(k)
NetC30_2: C30.2 HS4.1(OUT) R84.1 R88.1 U8.1(k)
NetC31_2: C31.2 HS5.1(OUT) R85.1 R89.1 U9.1(k)
NetC32_2: C32.2 HS6.1(OUT) R86.1 R90.1 U10.1(k)
NetC35_2: C35.2 U11.5(CT)
NetCR2_1: CR2.1 L3.1 TP21.1(G9) U3.2(Output)
NetD3_1: D3.1(A) R12.1
NetD7_1: D7.1(A) R32.1
NetD9_1: D9.1(A) R53.1
NetD11_1: D11.1(A) R79.1
NetD13_1: D13.1(A) R102.1
NetD15_1: D15.1(A) R119.1
NetHS1_3: HS1.3(VCC) P6.3
NetHS2_3: HS2.3(VCC) P7.3
NetHS3_3: HS3.3(VCC) P8.3
NetHS4_3: HS4.3(VCC) P10.3
NetHS5_3: HS5.3(VCC) P11.3
NetHS6_3: HS6.3(VCC) P12.3
NetJ2_1: J2.1 Q1.4(DRAIN) Q2.4(DRAIN)
NetJ3_2: J3.2 R20.2 RP2.1(CCW)
NetJ4_2: J4.2 Q3.1(B) R36.2
NetJ5_1: J5.1 Q4.3(SOURCE) Q5.3(SOURCE)
NetJ6_2: J6.2 R61.2 RP7.1(CCW)
NetJ7_2: J7.2 Q6.1(B) R83.2
NetJ8_1: J8.1 Q7.3(SOURCE) Q8.3(SOURCE)
NetJ9_2: J9.2 R107.2 RP11.1(CCW)
NetJ10_2: J10.2 Q9.1(B) R123.2
NetP1_2: P1.2 R2.1
NetP3_2: P3.2 R23.1
NetP4_2: P4.2 R45.1
NetP6_2: P6.2 R56.2
NetP7_2: P7.2 R57.2
NetP8_2: P8.2 R58.2
NetP9_2: P9.2 R67.1
NetP10_2: P10.2 R84.2
NetP11_2: P11.2 R85.2
NetP12_2: P12.2 R86.2
NetP13_2: P13.2 R95.1
NetP14_2: P14.2 R110.1
NetQ1_1: Q1.1(GATE) R18.1 TP11.1(G9)
NetQ1_3: Q1.3(SOURCE) R26.2 R28.2
NetQ2_1: Q2.1(GATE) R11.1 TP6.1(G9)
NetQ4_1: Q4.1(GATE) R52.1 TP28.1(G9)
NetQ5_1: Q5.1(GATE) R59.1 TP31.1(G9)
NetQ5_4: Q5.4(DRAIN) R70.2 R75.2
NetQ7_1: Q7.1(GATE) R101.1 TP44.1(G9)
NetQ8_1: Q8.1(GATE) R105.1 TP47.1(G9)
NetQ8_4: Q8.4(DRAIN) R113.2 R115.2
NetR9_1: R9.1 R11.2 U1.9(E1)
NetR18_2: R18.2 R25.2 U1.10(E2)
NetR20_1: R20.1 U1.6(RT)
NetR49_2: R49.2 RP5.3(CW)
NetR50_1: R50.1 R52.2 U4.9(E1)
NetR59_2: R59.2 R69.2 U4.10(E2)
NetR61_1: R61.1 U4.6(RT)
NetR64_2: R64.2 R72.1 U5.2(REF)
NetR65_2: R65.2 R73.1 U6.2(REF)
NetR66_2: R66.2 R74.1 U7.2(REF)
NetR88_2: R88.2 R91.1 U8.2(REF)
NetR89_2: R89.2 R92.1 U9.2(REF)
NetR90_2: R90.2 R93.1 U10.2(REF)
NetR99_1: R99.1 R101.2 U11.9(E1)
NetR105_2: R105.2 R112.2 U11.10(E2)
NetR107_1: R107.1 U11.6(RT)
NetRP5_2: RP5.2(WIPER) TP22.1(G9) U3.4(Feedback)

Not connected (* = marked no-connect by the designer): U1 3(FEEDBACK)*; U4 3(FEEDBACK)*; U11 3(FEEDBACK)*

## Notes on the sheet
- (in symbol Hall_Sensor) U_Hall
- (in symbol LM324AD_SOIC14, part A) +; -
- (in symbol LM324AD_SOIC14, part B) +; -
- (in symbol LM324AD_SOIC14, part C) +; -
- (in symbol LM324AD_SOIC14, part D) -; +

## Library data of the parts
C1-C4 C8-C10 C14-C18 C20 C21 C25 C26 C28 C29 C33 C35-C37 C39 C40 = C0805C104J4RACTU
C5 C7 = Cap Pol2: Polarized Capacitor (Axial); Value: 10uF; Published: 8-Jun-2000; LatestRevisionDate: 17-Jul-2002; LatestRevisionNote: Re-released for DXP Platform.; PackageReference: POLAR0.8; Publisher: Altium Limited; PackageDescription: Polarized Capacitor; 2 Leads
C6 C11-C13 C19 C27 C38 = EEE1HA101AP: Capacitor Polarised; Manufacturer_Name: Panasonic; Datasheet Link: http://industrial.panasonic.com/cdbs/www-data/pdf/RDE0000/ABA0000C1142.pdf; Manufacturer_Part_Number: EEE1HA101AP
C22-C24 C30-C32 = C0805C104J4RACTU: 100pF
C34 = ECA-1JHG222: No Description Available; Mfr_Name: Panasonic; Type: DEV; Copyright: Copyright (C) 2022 Ultra Librarian. All rights reserved.; Manufacturer_Part_Number: ECA-1JHG222; RefDes: RefDes
CR1 CR2 = 1N5822RL: No Description Available; Mfr_Name: STMicroelectronics; Type: DEV; Copyright: Copyright (C) 2022 Ultra Librarian. All rights reserved.; Manufacturer_Part_Number: 1N5822RL; RefDes: RefDes
D3 D7 D9 D11 D13 D15 = LED2: Typical RED, GREEN, YELLOW, AMBER GaAs LED; Published: 8-Jun-2000; LatestRevisionDate: 17-Jul-2002; LatestRevisionNote: Re-released for DXP Platform.; PackageVersion: Feb-2002; PackageReference: 3.2X1.6X1.1; Publisher: Altium Limited; PackageDescription: SM LED; 2 Flat Leads
J1 J2 J5 J8 = 691101710002: WR-TBL Series 101 Horizontal Entry Modular, Through Hole, pitch 5mm, 2p; Manufacturer: Wurth Elektronik; Pin Number: 2; Rated Current: 16A; Working Voltage: 250V; PCB/Cable/Panel: PCB; Modularity: Yes; ComponentLink1Description: Manufacturer Link; ComponentLink1URL: https://www.we-online.com/redexpert/article/691101710002?ad; ComponentLink2Description: Datasheet; ComponentLink2URL: https://www.we-online.com/redexpert/spec/691101710002?ad; Category: Terminal Blocks; Match Code: WR-TBL; Manufacturer Part Number: 691101710002; Mount: Through Hole; Operating Temperature Max: 105°C; Operating Temperature Min: -40°C; Packaging: Box; Pitch: 5mm; Orientation: Horizontal; Application: Pressure Clamp
L1-L3 = 7445720: SMD-Power Inductor WE-PD4, L = 100 µH; Inductance: 100 ÂµH; ComponentLink1Description: Manufacturer Link; ComponentLink2Description: Datasheet; DatasheetVersion: ver 1, Oct-2004; ComponentLink1URL: http://www.we-online.com; PackageVersion: 2004; PackageDescription: SMD Inductor, 2-Leads, Body 22.0 x 15.0 mm; ComponentLink2URL: http://www.we-online.de/katalog/media/pdf/7445720.pdf; PackageReference: WE-PD4-XL; PartNumber: 7445720
P1 P3 P4 P6-P14 = 61900311121: WR-WTB THT Male Vertical Locking Header, pitch 2.54mm, 3p; Pin Number: 3; Contact Resistance: 20mOhm; Rated Current: 3A; Withstanding Voltage: 1000VAC; Working Voltage: 250VAC; ComponentLink1Description: Manufacturer; ComponentLink1URL: http://www.we-online.de; ComponentLink2Description: Datasheet; ComponentLink2URL: https://www.we-online.com/catalog/datasheet/61900311121.pdf; Pitch: 2.54mm; Published Date: January 2020; Publisher: Wurth Elektronik; Mounting Technology: THT; Packaging: Bag; Operating Temperature: -40 to +105degC; Part Number: 61900311121; Gender: Male; Type: Vertical
P2 P5 = 61900811121: WR-WTB THT Male Vertical Locking Header, pitch 2.54mm, 8p; Pin Number: 8; Contact Resistance: 20mOhm; Rated Current: 3A; Withstanding Voltage: 1000VAC; Working Voltage: 250VAC; ComponentLink1Description: Manufacturer; ComponentLink1URL: http://www.we-online.de; ComponentLink2Description: Datasheet; ComponentLink2URL: https://www.we-online.com/catalog/datasheet/61900811121.pdf; Pitch: 2.54mm; Published Date: January 2020; Publisher: Wurth Elektronik; Mounting Technology: THT; Packaging: Bag; Operating Temperature: -40 to +105degC; Part Number: 61900811121; Gender: Male; Type: Vertical
Q2 Q5 Q8 = IRFR9024N: Insulated-Gate Field-Effect Transistor (IGFET), P-Channel, Enhancement,  Body Diode, Pin 1 Gate,  3 Source, 4 Drain, 3Pins; Manufacturer: Infineon Technologies; Manufacturer Order Number: IRFR9024N; PackageReference: PG-TO252-3-901
Q3 Q6 Q9 = BC847B,215: Transistor BJT NPN; Manufacturer_Name: Nexperia; Datasheet Link: https://assets.nexperia.com/documents/data-sheet/BC847_SER.pdf; Height: 1.1mm; Manufacturer_Part_Number: BC847B,215; Mouser Part Number: 771-BC847B-T/R; Mouser Price/Stock: https://www.mouser.co.uk/ProductDetail/Nexperia/BC847B215?qs=me8TqzrmIYXXIdUoxWnHgw%3D%3D; Arrow Part Number: BC847B,215; Arrow Price/Stock: https://www.arrow.com/en/products/bc847b215/nexperia?region=nac
R1 R2 R5 R12 R13 R20-R23 R27 R30 R32 R41-R45 R48 R53 R54 R61-R63 R67 R77 R79 R94 R95 R98 R102 R103 R107-R110 R117 R119 = CRCW08050000Z0EA
  R1 R44 R94: 100k: *
  R2 R5 R12 R13 R20-R23 R27 R30 R32 R41-R43 R45 R48 R53 R54 R61-R63 R67 R77 R79 R95 R98 R102 R103 R107-R110 R117 R119: 10k: *
R3 R24 R46 R68 R96 R111 = CRCW08050000Z0EA: 9.1k; 10k: *
R4 R9 R11 R14 R18 R19 R25 R34 R36 R47 R49 R50 R52 R55-R60 R64-R66 R69 R71-R74 R81 R83-R86 R88-R93 R97 R99 R101 R104-R106 R112 R114 R121 R123 = CRCW08050000Z0EA: 10k; 10k: *
R6-R8 R26 R35 R37-R39 R70 R82 R113 R122 = CRCW08050000Z0EA: 7.5k; 10k: *
R10 R15-R17 R29 R31 R40 R51 R76 R78 R87 R100 R116 R118 R124 = CRCW08050000Z0EA: 1k; 10k: *
R28 R75 R115 = TUW5JR10E: No Description Available; Mfr_Name: Ohmite; Copyright: Copyright (C) 2022 Ultra Librarian. All rights reserved.; Manufacturer_Part_Number: TUW5JR10E; RefDes: RefDes; Type: DEV
R33 R80 R120 = CRCW08050000Z0EA: 51k; 10k: *
RG1 = Reg_Fairchild_LM7805CT_eec: REG IC REG LINEAR 5V 1A TO220AB; Voltage Dropout (Max): 2V @ 1A (Typ); Voltage - Input (Max): 35V; helpURL: https://upverter.com/upn/revision/b27a7358b7dd93a3/; ComponentLink2Description: Datasheet; Temperature: -40°C to +125°C; Package: TO220; Supplier 2: Mouser; Price: 0.384521982769; Supplier 1: Digi-Key; ComponentLink1URL: https://upverter.com/upn/revision/b27a7358b7dd93a3/; Supplier Part Number 2: 512-LM7805CT; Supplier Part Number 1: LM7805CT-ND; Manufacturer: Fairchild; ComponentLink1Description: Upverter; ComponentLink2URL: https://www.fairchildsemi.com/datasheets/LM/LM7805.pdf; RoHS: TRUE; Mouser Part Number: 512-LM7805CT; Ipc Land Pattern Name: TO-220; Temperature Range High: +125°C; Digikey Description: REG IC REG LINEAR 5V 1A TO220AB; Digikey Part Number: LM7805CT-ND; Lead Free: yes; Temperature Range Low: -40°C; Voltage - Output: 5V; Current-Output: 1A
RP1-RP13 = 3296W-1-202LF
TP1-TP54 = TP_PCB?: Test_Point
U1 U4 U11 = TL494ID: Pulse-Width-Modulation Control Circuit with Voltage Control, 45 % Duty Cycle, -40 to +85 degC, 16-pin SOIC (D), Green (RoHS & no Sb/Br); Manufacturer: Texas Instruments; Regulated Outputs(#): 2; Topology: Boost, Buck, Flyback, Forward, Full-Bridge, Half-Bridge, Push-Pull; SubFamily: PWM Controller; Frequency(Max)(kHz): 300; Rating: Military; Duty Cycle(Max)(%): 45; ComponentLink1URL: http://www.ti.com/general/docs/lit/getliterature.tsp?genericPartNumber=TL494&fileType=pdf; DatasheetVersion: SLVS074E; Control Method: Voltage; ComponentLink1Description: Datasheet; Code_JEDEC: MS-012AC; PackageVersion: revM, Jun-2011; Eco-Plan: Green (RoHS & no Sb/Br); PartNumber: TL494ID; PackageDescription: 16-Pin Plastic Small Outline Integrated Circuit, 9.9 x 3.9 mm, Pitch 1.27 mm Pitch; Mounting Technology: Surface Mount; PackageReference: D16
U3 = LM2576D2T-005G
U5-U10 = IC_Nexperia_TL431AQDBZR,215_eec: IC VREF SHUNT ADJ SOT23-3; Voltage - Input: 2.495 V ~ 36 V; Tolerance: ±1%; Current - Output: 100mA; Number of Channels: 1; Current - Cathode: 600µA; Reference Type: Shunt, Adjustable, Precision; Other Names: 568-4890-6; helpURL: https://upverter.com/upn/revision/897efb4cb52176e6/; ComponentLink2Description: Datasheet; Temperature: -40°C to +125°C; Package: TO-236-3, SC-59, SOT-23-3; Supplier 2: Mouser; Price: 0.155797334872; Supplier 1: Digi-Key; ComponentLink1URL: https://upverter.com/upn/revision/897efb4cb52176e6/; Supplier Part Number 2: 771-TL431AQDBZR215; Supplier Part Number 1: 1727-4259-1-ND; Manufacturer: Nexperia; ComponentLink1Description: Upverter; ComponentLink2URL: http://assets.nexperia.com/documents/data-sheet/TL431_FAM.pdf; RoHS: TRUE; Mouser Part Number: 771-TL431AQDBZR215; Operating Temperature: -40°C ~ 125°C; Temperature Range High: +125°C; Packaging: Digi-Reel®; Digikey Description: IC VREF SHUNT ADJ SOT23-3; Digikey Part Number: 1727-4259-1-ND; Standard Package: 1; Lead Free: yes; Temperature Range Low: -40°C; Mounting Type: Surface Mount; Voltage - Output: 2.495 V ~ 36 V
Z1 = MM3Z5V1ST1G: Zener Diode; Manufacturer_Name: onsemi; Datasheet Link: http://www.onsemi.com/pub/Collateral/MM3Z2V4ST1-D.PDF; Height: 1.1mm; Manufacturer_Part_Number: MM3Z5V1ST1G; Mouser Part Number: 863-MM3Z5V1ST1G; Mouser Price/Stock: https://www.mouser.co.uk/ProductDetail/onsemi/MM3Z5V1ST1G?qs=HVbQlW5zcXXFXX%2FQxsNWFg%3D%3D; Arrow Part Number: MM3Z5V1ST1G; Arrow Price/Stock: https://www.arrow.com/en/products/mm3z5v1st1g/on-semiconductor?region=nac